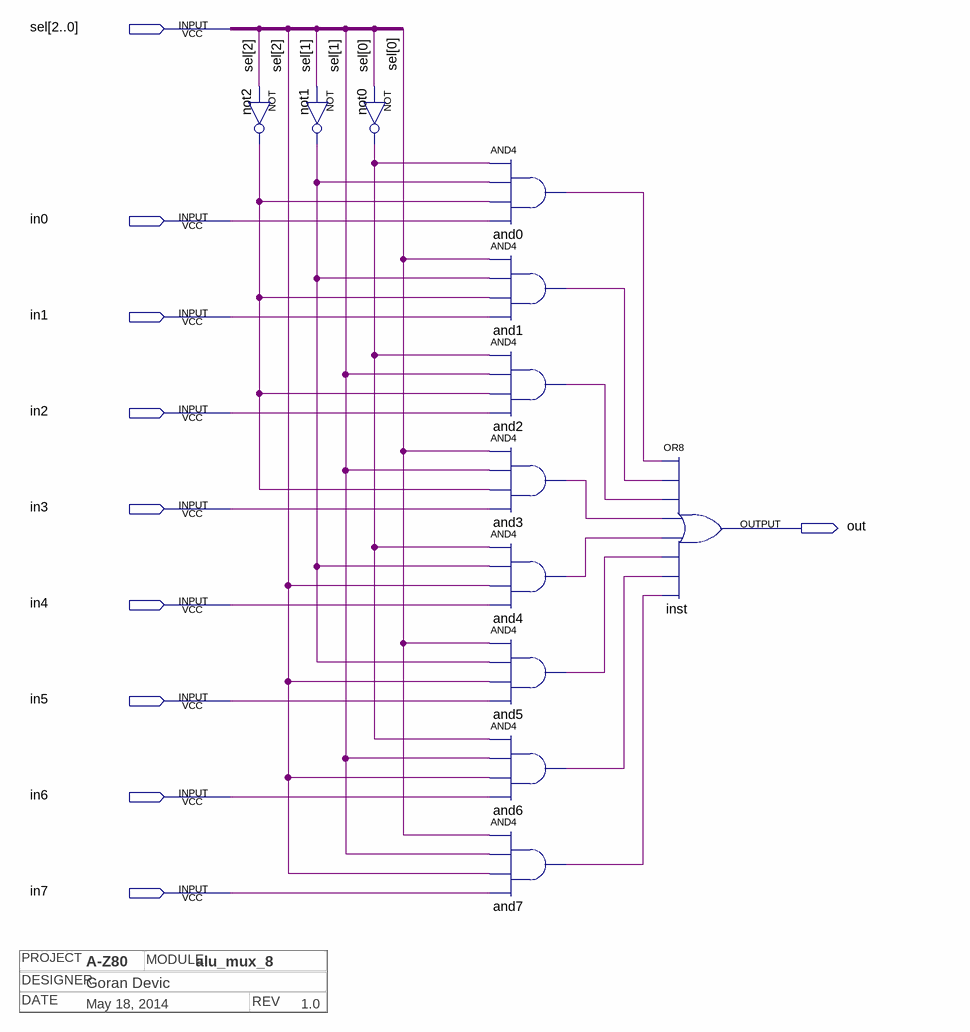
[diagram p0: schematic sheet]
// Quartus schematic alu_mux_8.bdf as structural Verilog: 12 symbols, 10 pins
// Title block: DATE: May 18, 2014; DESIGNER: Goran Devic; MODULE: alu_mux_8; PROJECT: A-Z80; REV: 1.0
module alu_mux_8 (
  input  [2:0] sel,
  input  in0,
  input  in1,
  input  in2,
  input  in3,
  input  in4,
  input  in5,
  input  in6,
  input  in7,
  output out
);

  wire and0_out, and1_out, and2_out, and3_out, and4_out, and5_out, and6_out, and7_out, not0_out, not1_out,
       not2_out;

  not not2 (not2_out, sel[2]);
  not not1 (not1_out, sel[1]);
  not not0 (not0_out, sel[0]);
  and and0 (and0_out, not0_out, not1_out, not2_out, in0);
  and and1 (and1_out, sel[0], not1_out, not2_out, in1);
  and and2 (and2_out, not0_out, sel[1], not2_out, in2);
  and and3 (and3_out, sel[0], sel[1], not2_out, in3);
  and and4 (and4_out, not0_out, not1_out, sel[2], in4);
  and and5 (and5_out, sel[0], not1_out, sel[2], in5);
  and and6 (and6_out, not0_out, sel[1], sel[2], in6);
  and and7 (and7_out, sel[0], sel[1], sel[2], in7);
  or inst (out, and0_out, and1_out, and2_out, and3_out, and4_out, and5_out, and6_out, and7_out);
endmodule
